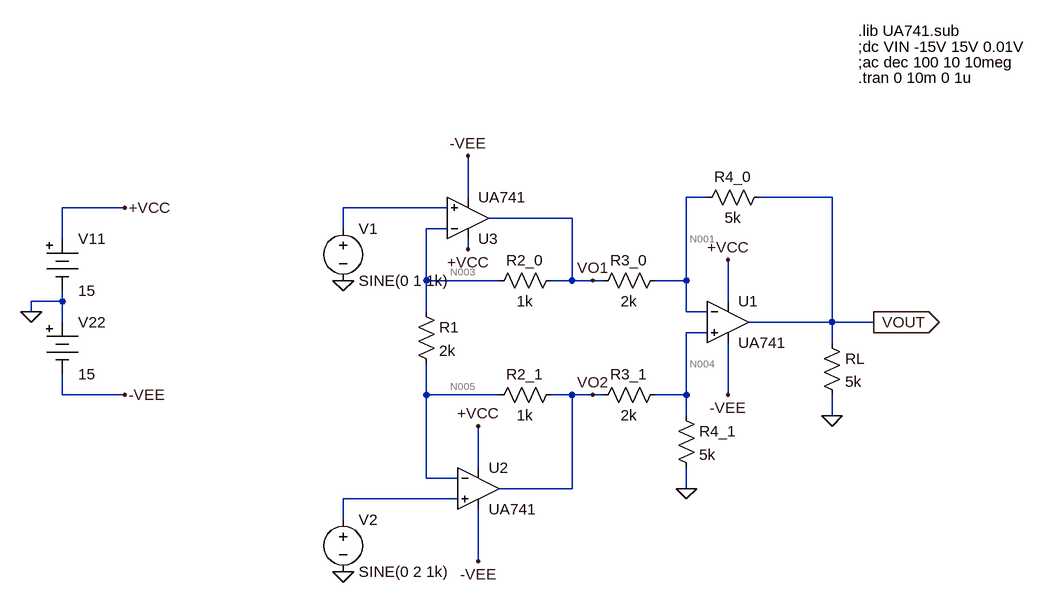
[diagram p0: schematic lab3-1.asc]
lab3-1.asc, the LTspice schematic file:
Version 4
SHEET 1 1040 684
WIRE 144 16 144 -48
WIRE 512 16 480 16
WIRE 704 16 592 16
WIRE -384 32 -480 32
WIRE 112 32 -48 32
WIRE 304 48 176 48
WIRE -48 64 -48 32
WIRE 112 64 80 64
WIRE -480 80 -480 32
WIRE 144 96 144 80
WIRE 80 144 80 64
WIRE 192 144 80 144
WIRE 304 144 304 48
WIRE 304 144 272 144
WIRE 336 144 304 144
WIRE 352 144 336 144
WIRE 480 144 480 16
WIRE 480 144 432 144
WIRE -480 176 -480 160
WIRE -480 176 -528 176
WIRE 544 176 544 112
WIRE -528 192 -528 176
WIRE 80 192 80 144
WIRE 480 192 480 144
WIRE 512 192 480 192
WIRE -480 208 -480 176
WIRE 704 208 704 16
WIRE 704 208 576 208
WIRE 768 208 704 208
WIRE 512 224 480 224
WIRE 704 240 704 208
WIRE -480 320 -480 288
WIRE -384 320 -480 320
WIRE 80 320 80 272
WIRE 192 320 80 320
WIRE 304 320 272 320
WIRE 336 320 304 320
WIRE 352 320 336 320
WIRE 480 320 480 224
WIRE 480 320 432 320
WIRE 544 320 544 240
WIRE 480 352 480 320
WIRE 704 352 704 320
WIRE 160 432 160 368
WIRE 80 448 80 320
WIRE 128 448 80 448
WIRE 304 464 304 320
WIRE 304 464 192 464
WIRE 480 464 480 432
WIRE 128 480 -48 480
WIRE -48 512 -48 480
WIRE 160 576 160 496
FLAG -528 192 0
FLAG -384 32 +VCC
FLAG 144 -48 -VEE
FLAG -384 320 -VEE
FLAG 160 368 +VCC
FLAG 544 112 +VCC
FLAG 160 576 -VEE
FLAG 544 320 -VEE
FLAG 768 208 VOUT
IOPIN 768 208 Out
FLAG 704 352 0
FLAG 480 464 0
FLAG 336 144 VO1
FLAG 336 320 VO2
FLAG 144 96 +VCC
FLAG -48 144 0
FLAG -48 592 0
SYMBOL Misc\\battery -480 64 R0
WINDOW 123 0 0 Left 2
WINDOW 39 0 0 Left 2
SYMATTR InstName V11
SYMATTR Value 15
SYMBOL Misc\\battery -480 192 R0
WINDOW 123 0 0 Left 2
WINDOW 39 0 0 Left 2
SYMATTR InstName V22
SYMATTR Value 15
SYMBOL Opamps\\opamp2 160 400 R0
SYMATTR InstName U2
SYMATTR Value UA741
SYMBOL Opamps\\opamp2 544 144 R0
SYMATTR InstName U1
SYMATTR Value UA741
SYMBOL res 688 224 R0
SYMATTR InstName RL
SYMATTR Value 5k
SYMBOL res 608 0 R90
WINDOW 0 0 56 VBottom 2
WINDOW 3 32 56 VTop 2
SYMATTR InstName R4_0
SYMATTR Value 5k
SYMBOL res 464 336 R0
SYMATTR InstName R4_1
SYMATTR Value 5k
SYMBOL res 448 128 R90
WINDOW 0 0 56 VBottom 2
WINDOW 3 32 56 VTop 2
SYMATTR InstName R3_0
SYMATTR Value 2k
SYMBOL res 448 304 R90
WINDOW 0 0 56 VBottom 2
WINDOW 3 32 56 VTop 2
SYMATTR InstName R3_1
SYMATTR Value 2k
SYMBOL res 64 176 R0
SYMATTR InstName R1
SYMATTR Value 2k
SYMBOL res 288 128 R90
WINDOW 0 0 56 VBottom 2
WINDOW 3 32 56 VTop 2
SYMATTR InstName R2_0
SYMATTR Value 1k
SYMBOL res 288 304 R90
WINDOW 0 0 56 VBottom 2
WINDOW 3 32 56 VTop 2
SYMATTR InstName R2_1
SYMATTR Value 1k
SYMBOL voltage -48 48 R0
WINDOW 123 0 0 Left 2
WINDOW 39 0 0 Left 2
SYMATTR InstName V1
SYMATTR Value SINE(0 1 1k)
SYMBOL voltage -48 496 R0
WINDOW 123 0 0 Left 2
WINDOW 39 0 0 Left 2
SYMATTR InstName V2
SYMATTR Value SINE(0 2 1k)
SYMBOL Opamps\\opamp2 144 112 M180
SYMATTR InstName U3
SYMATTR Value UA741
TEXT 744 -240 Left 2 !.lib UA741.sub
TEXT 744 -216 Left 2 !;dc VIN -15V 15V 0.01V
TEXT 744 -192 Left 2 !;ac dec 100 10 10meg
TEXT 744 -168 Left 2 !.tran 0 10m 0 1u

The netlist it stands for:
* lab3-1.asc
V11 +VCC 0 15
V22 0 -VEE 15
XU2 N006 N005 +VCC -VEE VO2 UA741  ; pins In+ In- V+ V- OUT
XU1 N004 N001 +VCC -VEE VOUT UA741  ; pins In+ In- V+ V- OUT
RL VOUT 0 5k
R4_0 VOUT N001 5k
R4_1 N004 0 5k
R3_0 N001 VO1 2k
R3_1 N004 VO2 2k
R1 N003 N005 2k
R2_0 VO1 N003 1k
R2_1 VO2 N005 1k
V1 N002 0 SINE(0 1 1k)
V2 N006 0 SINE(0 2 1k)
XU3 N002 N003 +VCC -VEE VO1 UA741  ; pins In+ In- V+ V- OUT
.lib UA741.sub
;dc VIN -15V 15V 0.01V
;ac dec 100 10 10meg
.tran 0 10m 0 1u
.backanno
.end

* Results of the author's LTspice run, read from the files saved beside the schematic
* Operating Point, zero values left out:
*   V(+vcc) = 15 V
*   V(-vee) = -15 V
*   V(vo2) = 90.94 µV
*   V(n005) = 11.18 µV
*   V(vout) = 39.26 µV
*   V(n001) = -37.76 µV
*   V(n004) = -48.95 µV
*   V(vo1) = 90.94 µV
*   V(n003) = 11.18 µV
*   I(R2_1) = 79.76 nA
*   I(R2_0) = 79.76 nA
*   I(R3_1) = -69.95 nA
*   I(R3_0) = -64.35 nA
*   I(R4_1) = -9.79 nA
*   I(R4_0) = 15.41 nA
*   I(Rl) = 7.852 nA
*   I(V2) = -79.74 nA
*   I(V1) = -79.74 nA
*   I(V22) = -5 mA
*   I(V11) = -5 mA
*   Ix(u2:1) = 79.74 nA
*   Ix(u2:2) = 79.76 nA
*   Ix(u2:3) = 1.667 mA
*   Ix(u2:4) = -1.667 mA
*   Ix(u2:5) = -149.7 nA
*   Ix(u1:1) = 79.74 nA
*   Ix(u1:2) = 79.76 nA
*   Ix(u1:3) = 1.667 mA
*   Ix(u1:4) = -1.667 mA
*   Ix(u1:5) = -23.26 nA
*   Ix(u3:1) = 79.74 nA
*   Ix(u3:2) = 79.76 nA
*   Ix(u3:3) = 1.667 mA
*   Ix(u3:4) = -1.667 mA
*   Ix(u3:5) = -144.1 nA
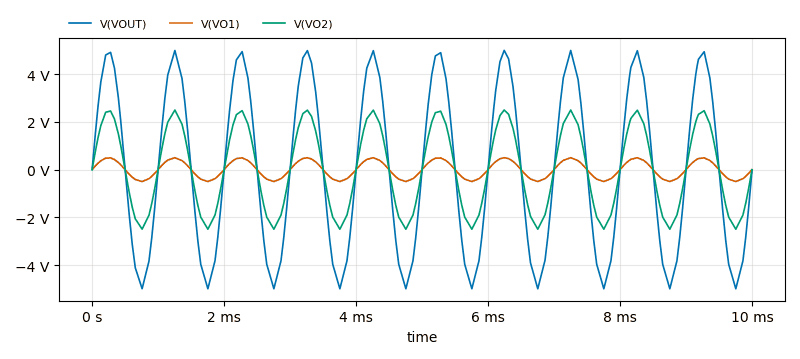
[diagram p1: Transient Analysis of lab3-1.asc, plotted from the saved traces]
* Transient Analysis, 1 run:
*   V(VOUT): min -4.992 V, max 4.996 V, average 13.75 mV, rms 3.469 V, last -27.33 mV
*   V(VO1): min -499.1 mV, max 499.8 mV, average 1.462 mV, rms 346.9 mV, last 842 µV
*   V(VO2): min -2.496 V, max 2.498 V, average 6.948 mV, rms 1.734 V, last -3.367 mV